# EAGLE design v1 (EAGLE 9.6.2)
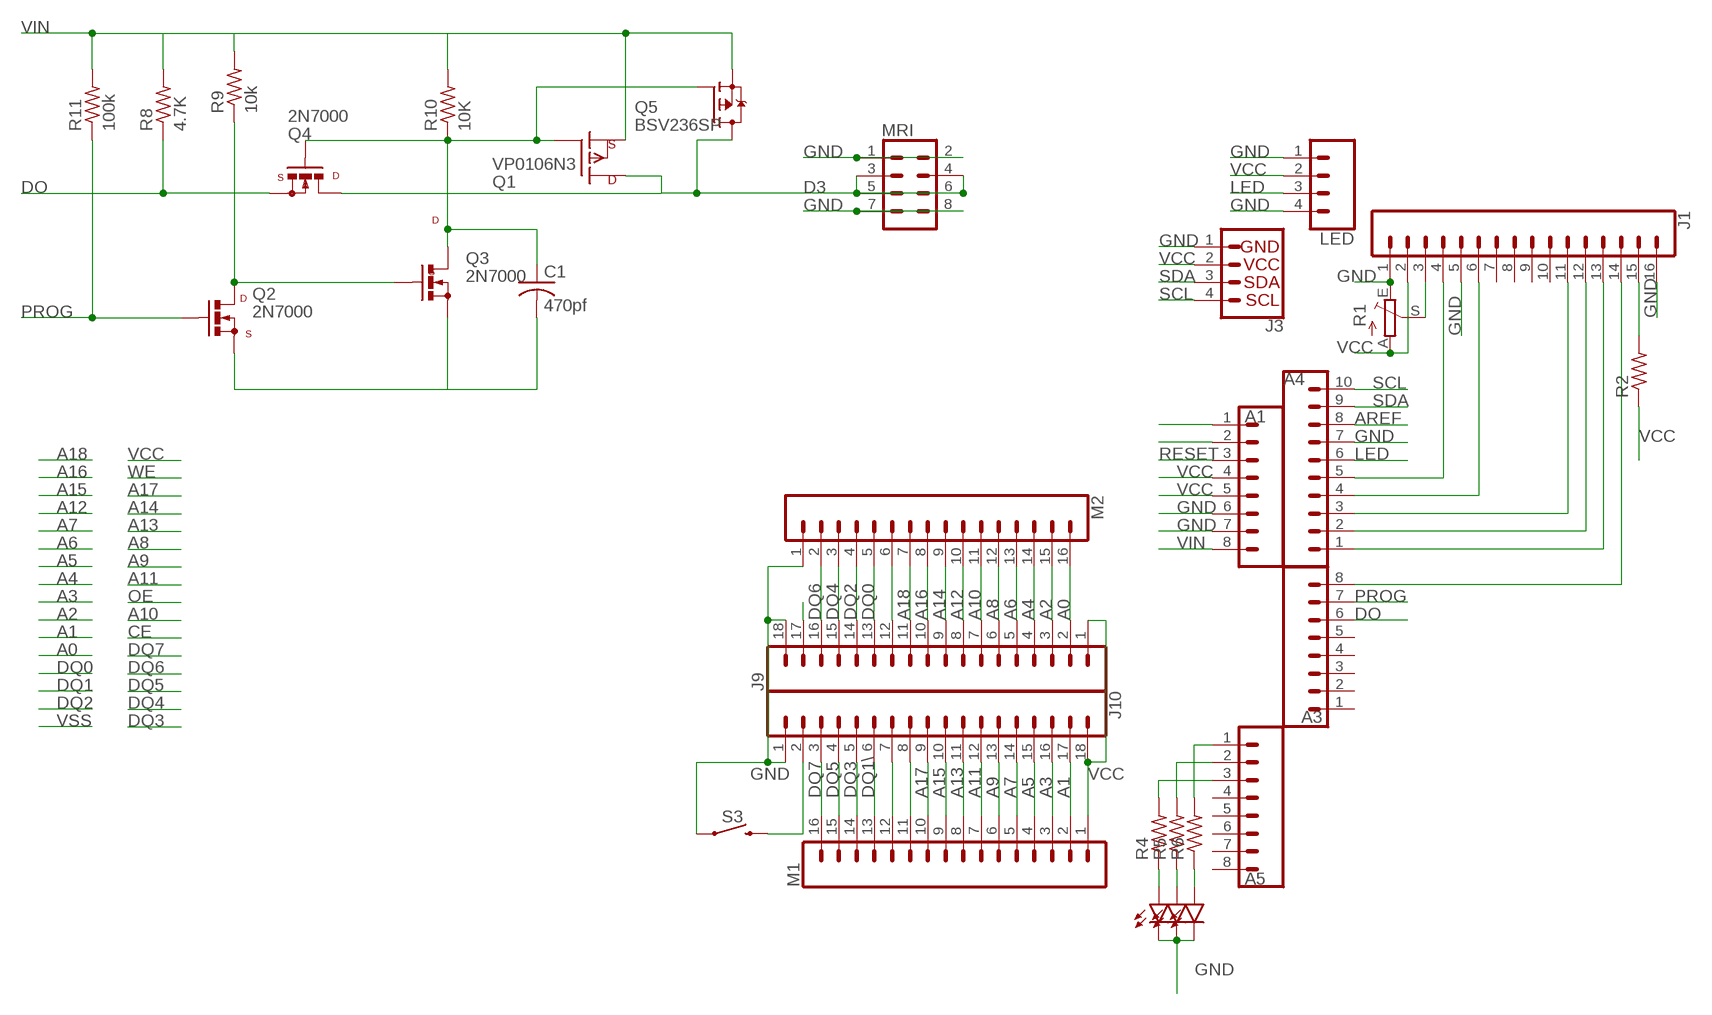
[diagram p0: schematic, sheet 1]

## Parts
A1  CONN_08FEMALE_LOCK  [1X08_FEMALE_LOCK]
A3  CONN_08FEMALE_LOCK  [1X08_FEMALE_LOCK]
A4  CONN_10LOCK  [1X10_LOCK]
A5  CONN_08FEMALE_LOCK  [1X08_FEMALE_LOCK]
C1  470pf  C-US025-025X050  [C025-025X050]
D1  LED3MM  [LED_3MM]
D2  LED3MM  [LED_3MM]
D3  LED3MM  [LED_3MM]
J1  CONN_16LOCK  [1X16_LOCK]
J3  I2C_STANDARD  [1X04]
J9  CONN_18SILK  [1X18]
J10  CONN_18SILK  [1X18]
LED  CONN_04LOCK  [1X04_LOCK]
M1  CONN_16MACHIINE-PIN_LOCK  [1X16_MACHINE-PIN-HEADER_LOCK.004]
M2  CONN_16MACHIINE-PIN_LOCK  [1X16_MACHINE-PIN-HEADER_LOCK.004]
MRI  CONN_04X2  [2X4]
Q1  VP0106N3  BSS110TO920  [TO92-]
Q2  2N7000  BS170T092-  [TO92-LINE]
Q3  2N7000  BS170T092-  [TO92-LINE]
Q4  2N7000  BS170T092-  [TO92-LINE]
Q5  BSV236SP  [SOT363_INFINEON]
R1  TRIM_EU-B64Y  [B64Y]
R2  R-US_0309/10  [0309/10]
R4  R-US_0309/10  [0309/10]
R5  R-US_0309/10  [0309/10]
R6  R-US_0309/10  [0309/10]
R8  4.7K  R-US_0207/2V  [0207/2V]
R9  10k  R-US_0309/10  [0309/10]
R10  10K  R-US_0207/2V  [0207/2V]
R11  100k  R-US_0309/10  [0309/10]
S3  MOMENTARY-SWITCH-SPST-PTH-6.0MM  [TACTILE_SWITCH_PTH_6.0MM]

## Nets
A0: J9.2 M2.16
A1: J10.17 M1.2
A2: J9.3 M2.15
A3: J10.16 M1.3
A4: J9.4 M2.14
A5: J10.15 M1.4
A6: J9.5 M2.13
A7: J10.14 M1.5
A8: J9.6 M2.12
A9: J10.13 M1.6
A10: J9.7 M2.11
A11: J10.12 M1.7
A12: J9.8 M2.10
A13: J10.11 M1.8
A14: J9.9 M2.9
A15: J10.10 M1.9
A16: J9.10 M2.8
A17: J10.9 M1.10
A18: J9.11 M2.7
AREF: A4.8
D3: MRI.3 MRI.4 MRI.5 MRI.6 Q1.1(D) Q4.1(D) Q5.1(D) Q5.2(D) Q5.5(D) Q5.6(D)
DO: A3.6 Q4.3(S) R8.1
DQ0: J9.13 M2.5
DQ1\: J10.6 M1.13
DQ2: J9.14 M2.4
DQ3: J10.5 M1.14
DQ4: J9.15 M2.3
DQ5: J10.4 M1.15
DQ6: J9.16 M2.2
DQ7: J10.3 M1.16
GND: A1.6 A1.7 A4.7 D1.K(C) D2.K(C) D3.K(C) J1.1 J1.5 J1.16 J3.1 J9.18 J10.1 LED.1 LED.4 M2.1 MRI.1 MRI.2 MRI.7 MRI.8 R1.E S3.1
LED: A4.6 LED.3
N$3: A4.3 J1.11
N$4: J1.3 R1.S
N$7: J1.15 R2.2
N$8: A4.2 J1.12
N$9: A4.1 J1.13
N$10: A3.8 J1.14
N$11: A5.1 R6.2
N$12: A4.4 J1.6
N$13: A4.5 J1.4
N$14: A5.2 R5.2
N$15: A5.3 R4.2
N$16: D3.A R6.1
N$17: D2.A R5.1
N$18: D1.A R4.1
N$22: Q2.1(D) Q3.2(G) R9.1
N$24: C1.2 Q2.3(S) Q3.3(S)
N$25: C1.1 Q1.2(G) Q3.1(D) Q4.2(G) Q5.3(G) R10.1
N$49: A1.2
N$50: A1.1
N$52: J9.17
N$57: J9.12 M2.6
N$79: J10.8 M1.11
N$80: J10.7 M1.12
N$85: J10.2 S3.3
PROG: A3.7 Q2.2(G) R11.1
RESET: A1.3
SCL: A4.10 J3.4
SDA: A4.9 J3.3
VCC: A1.4 A1.5 J1.2 J3.2 J9.1 J10.18 LED.2 M1.1 R1.A R2.1
VIN: A1.8 Q1.3(S) Q5.4(S) R8.2 R9.2 R10.2 R11.2
Unconnected: A3.1 A3.2 A3.3 A3.4 A3.5 A5.4 A5.5 A5.6 A5.7 A5.8 J1.7 J1.8 J1.9 J1.10

## Notes on the sheet
- S | D
- D
- S
- D
- S

## Library data of the parts
A1 A3 A5 = SparkFun-Connectors:CONN_08: Multi connection point. Often used as Generic Header-pin footprint for 0.1 inch spaced/style header connections On any of the 0.1 inch spaced packages, you can populate with these: Break Away Headers - Straight <https://www.sparkfun.com/products/116> (PRT-00116) Break Away Male Headers - Right Angle <https://www.sparkfun.com/products/553> (PRT-00553) Female Headers <https://www.sparkfun.com/products/115> (PRT-00115) Break Away Headers - Machine Pin <https://www.sparkfun.com/products/117> (PRT-00117) Break Away Female Headers - Swiss Machine Pin <https://www.sparkfun.com/products/743> (PRT-00743) Arduino Stackable Header - 8 Pin <https://www.sparkfun.com/products/9279> (PRT-09279) For SCREWTERMINALS and SPRING TERMINALS visit here: Screw Terimnals on SparkFun.com <https://www.sparkfun.com/search/results?term=Screw+Terminals> (5mm/3.5mm/2.54mm spacing) This device is also useful as a general connection point to wire up your design to another part of your project. Our various solder wires solder well into these plated through hole pads. Hook-Up Wire - Assortment (Stranded, 22 AWG) <https://www.sparkfun.com/products/11375> (PRT-11375) Hook-Up Wire - Assortment (Solid Core, 22 AWG) <https://www.sparkfun.com/products/11367> (PRT-11367) View the entire wire category on our website here <https://www.sparkfun.com/categories/141> Special notes: Molex polarized connector foot print use with SKU : PRT-08231 with associated crimp pins and housings. 1MM SMD Version SKU: PRT-10208 NOTES ON THE VARIANTS LOCK and LOCK_LONGPADS... This footprint was designed to help hold the alignment of a through-hole component (i.e. 6-pin header) while soldering it into place. You may notice that each hole has been shifted either up or down by 0.005 of an inch from it's more standard position (which is a perfectly straight line). This slight alteration caused the pins (the squares in the middle) to touch the edges of the holes. Because they are alternating, it causes a "brace" to hold the component in place. 0.005 has proven to be the perfect amount of "off-center" position when using our standard breakaway headers. Although looks a little odd when you look at the bare footprint, once you have a header in there, the alteration is very hard to notice. Also,if you push a header all the way into place, it is covered up entirely on the bottom side.; PROD_ID: CONN-09233; SF_ID: PRT-09279
A4 = SparkFun-Connectors:CONN_10: Multi connection point. Often used as Generic Header-pin footprint for 0.1 inch spaced/style header connections On any of the 0.1 inch spaced packages, you can populate with these: Break Away Headers - Straight <https://www.sparkfun.com/products/116> (PRT-00116) Break Away Male Headers - Right Angle <https://www.sparkfun.com/products/553> (PRT-00553) Female Headers <https://www.sparkfun.com/products/115> (PRT-00115) Break Away Headers - Machine Pin <https://www.sparkfun.com/products/117> (PRT-00117) Break Away Female Headers - Swiss Machine Pin <https://www.sparkfun.com/products/743> (PRT-00743) Arduino Stackable Header - 10 Pin <https://www.sparkfun.com/products/11376> (PRT-11376) For SCREWTERMINALS and SPRING TERMINALS visit here: Screw Terimnals on SparkFun.com <https://www.sparkfun.com/search/results?term=Screw+Terminals> (5mm/3.5mm/2.54mm spacing) This device is also useful as a general connection point to wire up your design to another part of your project. Our various solder wires solder well into these plated through hole pads. Hook-Up Wire - Assortment (Stranded, 22 AWG) <https://www.sparkfun.com/products/11375> (PRT-11375) Hook-Up Wire - Assortment (Solid Core, 22 AWG) <https://www.sparkfun.com/products/11367> (PRT-11367) View the entire wire category on our website here <https://www.sparkfun.com/categories/141> Special notes: Molex polarized connector foot print use with SKU : PRT-08231 with associated crimp pins and housings. 1MM SMD Version SKU: PRT-10208 NOTES ON THE VARIANTS LOCK and LOCK_LONGPADS... This footprint was designed to help hold the alignment of a through-hole component (i.e. 6-pin header) while soldering it into place. You may notice that each hole has been shifted either up or down by 0.005 of an inch from it's more standard position (which is a perfectly straight line). This slight alteration caused the pins (the squares in the middle) to touch the edges of the holes. Because they are alternating, it causes a "brace" to hold the component in place. 0.005 has proven to be the perfect amount of "off-center" position when using our standard breakaway headers. Although looks a little odd when you look at the bare footprint, once you have a header in there, the alteration is very hard to notice. Also,if you push a header all the way into place, it is covered up entirely on the bottom side.
C1 = rcl:C-US: CAPACITOR, American symbol
D1-D3 = SparkFun-LED:LED: LED (Generic) Standard schematic elements and footprints for 5mm, 3mm, 1206, and 0603 sized LEDs. Generic LEDs with no color specified.; PROD_ID: DIO-08794
J1 M1 M2 = SparkFun-Connectors:CONN_16: Multi connection point. Often used as Generic Header-pin footprint for 0.1 inch spaced/style header connections On any of the 0.1 inch spaced packages, you can populate with these: Break Away Headers - Straight <https://www.sparkfun.com/products/116> (PRT-00116) Break Away Male Headers - Right Angle <https://www.sparkfun.com/products/553> (PRT-00553) Female Headers <https://www.sparkfun.com/products/115> (PRT-00115) Break Away Headers - Machine Pin <https://www.sparkfun.com/products/117> (PRT-00117) Break Away Female Headers - Swiss Machine Pin <https://www.sparkfun.com/products/743> (PRT-00743) For SCREWTERMINALS and SPRING TERMINALS visit here: Screw Terimnals on SparkFun.com <https://www.sparkfun.com/search/results?term=Screw+Terminals> (5mm/3.5mm/2.54mm spacing) This device is also useful as a general connection point to wire up your design to another part of your project. Our various solder wires solder well into these plated through hole pads. Hook-Up Wire - Assortment (Stranded, 22 AWG) <https://www.sparkfun.com/products/11375> (PRT-11375) Hook-Up Wire - Assortment (Solid Core, 22 AWG) <https://www.sparkfun.com/products/11367> (PRT-11367) View the entire wire category on our website here <https://www.sparkfun.com/categories/141> Special notes: Molex polarized connector foot print use with SKU : PRT-08231 with associated crimp pins and housings. 1MM SMD Version SKU: PRT-10208 NOTES ON THE VARIANTS LOCK and LOCK_LONGPADS... This footprint was designed to help hold the alignment of a through-hole component (i.e. 6-pin header) while soldering it into place. You may notice that each hole has been shifted either up or down by 0.005 of an inch from it's more standard position (which is a perfectly straight line). This slight alteration caused the pins (the squares in the middle) to touch the edges of the holes. Because they are alternating, it causes a "brace" to hold the component in place. 0.005 has proven to be the perfect amount of "off-center" position when using our standard breakaway headers. Although looks a little odd when you look at the bare footprint, once you have a header in there, the alteration is very hard to notice. Also,if you push a header all the way into place, it is covered up entirely on the bottom side.
J3 = SparkFun-Connectors:I2C_STANDARD: SparkFun I2C Standard Pinout Header SparkFun has standardized on a pinout for all I2C based sensor breakouts. This pinout allows I2C boards to be plugged directly into the headers on Arduino Uno compatible boards, and to be daisy chained easily. Example SparkFun Products: SparkFun Atmospheric Sensor Breakout - BME280 <https://www.sparkfun.com/products/13676> SparkFun Altitude/Pressure Sensor Breakout - MPL3115A2 <https://www.sparkfun.com/products/11084> SparkFun TOF Range Finder Sensor - VL6180 <https://www.sparkfun.com/products/12785>
J9 J10 = SparkFun-Connectors:CONN_18: Multi connection point. Often used as Generic Header-pin footprint for 0.1 inch spaced/style header connections On any of the 0.1 inch spaced packages, you can populate with these: Break Away Headers - Straight <https://www.sparkfun.com/products/116> (PRT-00116) Break Away Male Headers - Right Angle <https://www.sparkfun.com/products/553> (PRT-00553) Female Headers <https://www.sparkfun.com/products/115> (PRT-00115) Break Away Headers - Machine Pin <https://www.sparkfun.com/products/117> (PRT-00117) Break Away Female Headers - Swiss Machine Pin <https://www.sparkfun.com/products/743> (PRT-00743) For SCREWTERMINALS and SPRING TERMINALS visit here: Screw Terimnals on SparkFun.com <https://www.sparkfun.com/search/results?term=Screw+Terminals> (5mm/3.5mm/2.54mm spacing) This device is also useful as a general connection point to wire up your design to another part of your project. Our various solder wires solder well into these plated through hole pads. Hook-Up Wire - Assortment (Stranded, 22 AWG) <https://www.sparkfun.com/products/11375> (PRT-11375) Hook-Up Wire - Assortment (Solid Core, 22 AWG) <https://www.sparkfun.com/products/11367> (PRT-11367) View the entire wire category on our website here <https://www.sparkfun.com/categories/141> Special notes: Molex polarized connector foot print use with SKU : PRT-08231 with associated crimp pins and housings. 1MM SMD Version SKU: PRT-10208 NOTES ON THE VARIANTS LOCK and LOCK_LONGPADS... This footprint was designed to help hold the alignment of a through-hole component (i.e. 6-pin header) while soldering it into place. You may notice that each hole has been shifted either up or down by 0.005 of an inch from it's more standard position (which is a perfectly straight line). This slight alteration caused the pins (the squares in the middle) to touch the edges of the holes. Because they are alternating, it causes a "brace" to hold the component in place. 0.005 has proven to be the perfect amount of "off-center" position when using our standard breakaway headers. Although looks a little odd when you look at the bare footprint, once you have a header in there, the alteration is very hard to notice. Also,if you push a header all the way into place, it is covered up entirely on the bottom side.
LED = SparkFun-Connectors:CONN_04: Multi connection point. Often used as Generic Header-pin footprint for 0.1 inch spaced/style header connections On any of the 0.1 inch spaced packages, you can populate with these: Break Away Headers - Straight <https://www.sparkfun.com/products/116> (PRT-00116) Break Away Male Headers - Right Angle <https://www.sparkfun.com/products/553> (PRT-00553) Female Headers <https://www.sparkfun.com/products/115> (PRT-00115) Break Away Headers - Machine Pin <https://www.sparkfun.com/products/117> (PRT-00117) Break Away Female Headers - Swiss Machine Pin <https://www.sparkfun.com/products/743> (PRT-00743) For SCREWTERMINALS and SPRING TERMINALS visit here: Screw Terimnals on SparkFun.com <https://www.sparkfun.com/search/results?term=Screw+Terminals> (5mm/3.5mm/2.54mm spacing) This device is also useful as a general connection point to wire up your design to another part of your project. Our various solder wires solder well into these plated through hole pads. Hook-Up Wire - Assortment (Stranded, 22 AWG) <https://www.sparkfun.com/products/11375> (PRT-11375) Hook-Up Wire - Assortment (Solid Core, 22 AWG) <https://www.sparkfun.com/products/11367> (PRT-11367) View the entire wire category on our website here <https://www.sparkfun.com/categories/141> Special notes: Molex polarized connector foot print use with SKU : PRT-08231 with associated crimp pins and housings. 1MM SMD Version SKU: PRT-10208; PROD_ID: CONN-09696
MRI = SparkFun-Connectors:CONN_04X2: Multi connection point. Often used as Generic Header-pin footprint for 0.1 inch spaced/style header connections On any of the 0.1 inch spaced packages, you can populate with these: Break Away Headers - Straight <https://www.sparkfun.com/products/116> (PRT-00116) Break Away Male Headers - Right Angle <https://www.sparkfun.com/products/553> (PRT-00553) Female Headers <https://www.sparkfun.com/products/115> (PRT-00115) Break Away Headers - Machine Pin <https://www.sparkfun.com/products/117> (PRT-00117) Break Away Female Headers - Swiss Machine Pin <https://www.sparkfun.com/products/743> (PRT-00743)
Q1 = transistor-fet:BSS110: P-Channel Enhancement MOSFET -50V; -0,17A; 6Ohm
Q2-Q4 = transistor-small-signal:BS170: N-CHANNEL MOS FET
Q5 = transistor-fet:BSV236SP: OptiMOS(R)-P Small-Signal-Transistor P-Channel, Enhancement mode, Super Logic Level (2.5 V rated) Source: http://www.infineon.com/upload/Document/BSV236SP_Rev1.3.pdf
R1 = pot:TRIM_EU-: POTENTIOMETER
R2 R4-R6 = rcl:R-US_: RESISTOR, American symbol; SPICEPREFIX: R
R8-R11 = rcl:R-US_: RESISTOR, American symbol
S3 = SparkFun-Switches:MOMENTARY-SWITCH-SPST: Momentary Switch (Pushbutton) - SPST Normally-open (NO) SPST momentary switches (buttons, pushbuttons). Variants PTH-12MM - 12mm square, through-hole Momentary Pushbutton Switch - 12mm Square <https://www.sparkfun.com/products/9190> (COM-09190) PTH-6.0MM, PTH-6.0MM-KIT - 6.0mm square, through-hole Mini Pushbutton Switch <https://www.sparkfun.com/products/97> (COM-00097) KIT package intended for soldering kit's - only one side of pads' copper is exposed. PTH-RIGHT-ANGLE-KIT - Right-angle, through-hole Right Angle Tactile Button <https://www.sparkfun.com/products/10791> - Used on SparkFun BigTime Watch Kit <https://www.sparkfun.com/products/11734> SMD-12MM - 12mm square, surface-mount Tactile Button - SMD (12mm) <https://www.sparkfun.com/products/12993> (COM-12993) Used on SparkFun PicoBoard <https://www.sparkfun.com/products/11888> SMD-4.5MM - 4.5mm Square Trackball Switch Used on SparkFun Blackberry Trackballer Breakout <https://www.sparkfun.com/products/13169> SMD-4.6MMX2.8MM - 4.60mm x 2.80mm, surface mount Used on SparkFun Pro Micro - RP2040 <https://www.sparkfun.com/products/17717> SMD-5.2MM, SMD-5.2-REDUNDANT - 5.2mm square, surface-mount Mini Pushbutton Switch - SMD <https://www.sparkfun.com/products/8720> (COM-08720) Used on Arduino Pro Mini <https://www.sparkfun.com/products/11114> REDUNDANT package connects both switch circuits together SMD-6.0X3.5MM - 6.0 x 3.5mm, surface mount Momentary Reset Switch SMD <https://www.sparkfun.com/products/8229> (COM-08229) SMD-6.2MM-TALL - 6.2mm square, surface mount Tactile Button - SMD (6mm) <https://www.sparkfun.com/products/12992> Used on SparkFun Digital Sandbox <https://www.sparkfun.com/products/12651> SMD-RIGHT-ANGLE - Right-angle, surface mount Used on SparkFun Block for Intel® Edison - Arduino <https://www.sparkfun.com/products/13036>; PROD_ID: SWCH-08441; SF_SKU: COM-00097

## Board
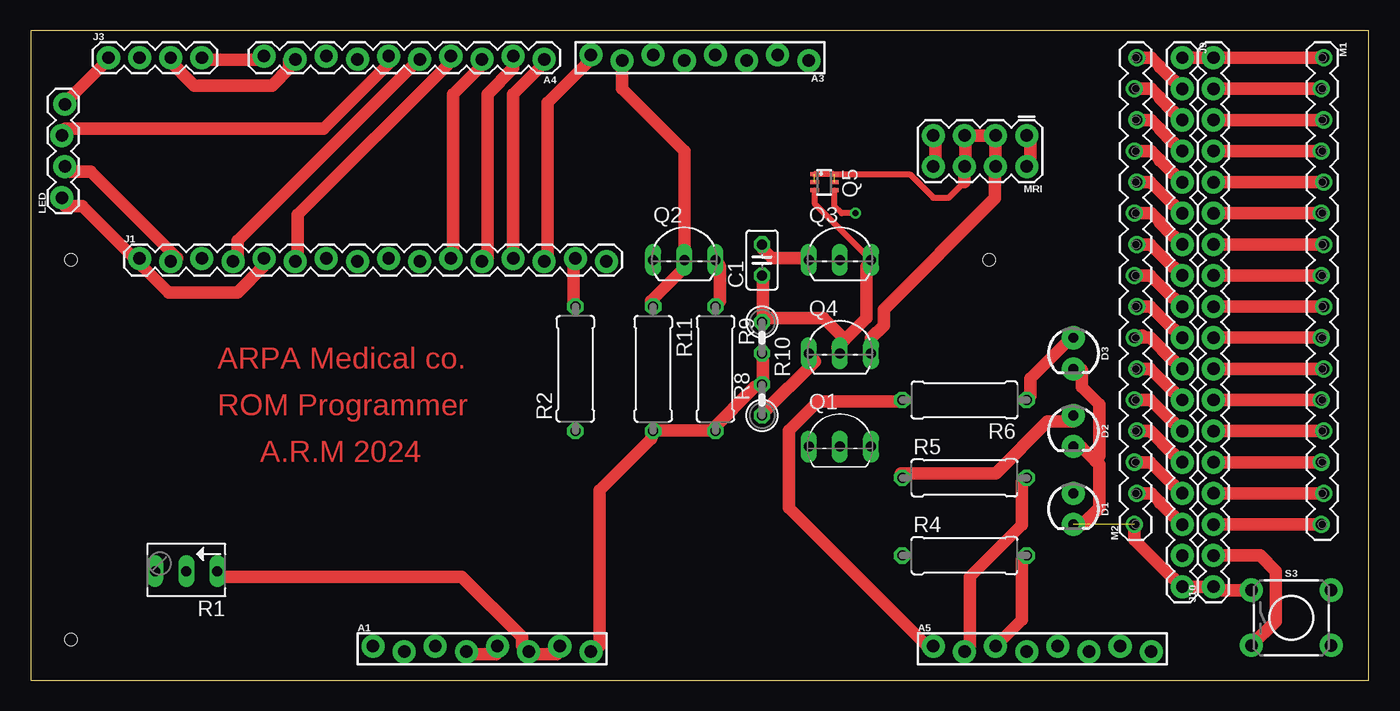
[diagram p1: board, top side]
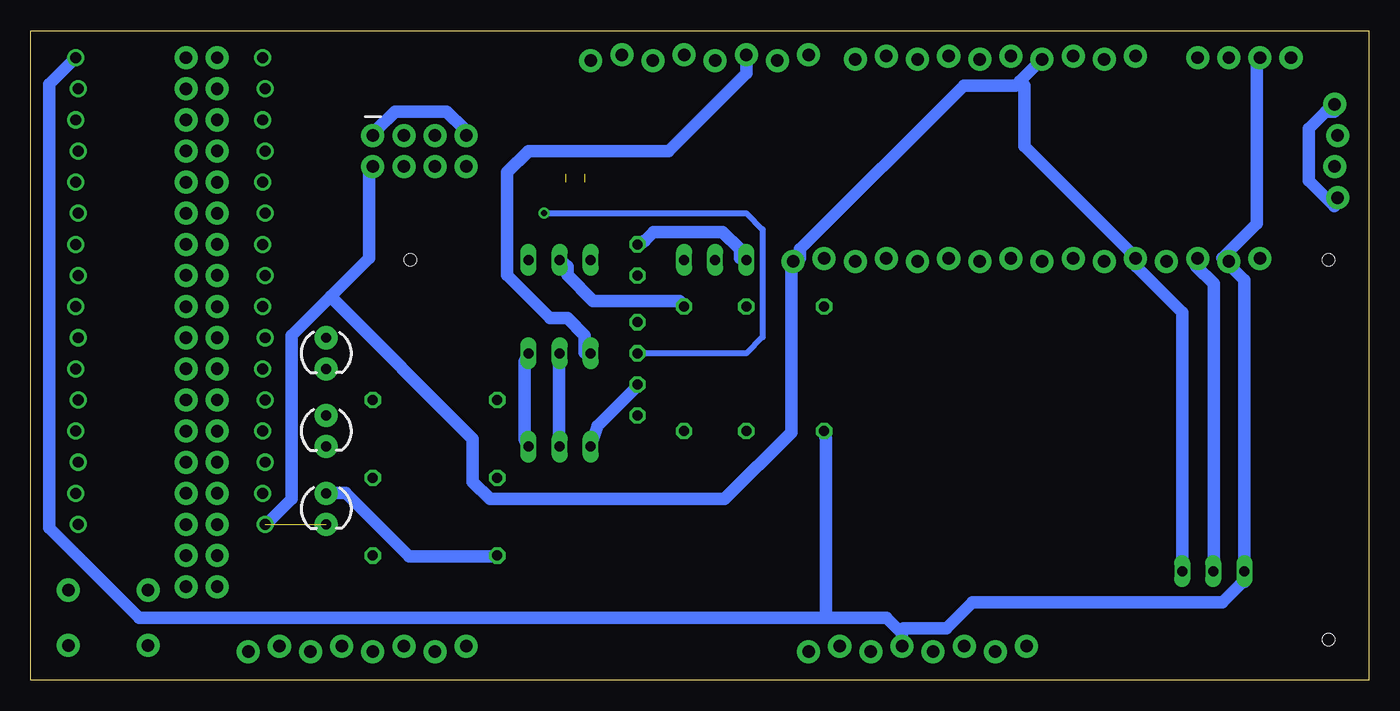
[diagram p2: board, bottom side, seen from below]

Size 109.2 x 53.01 mm. Coordinates in mm from the lower left corner, seen from the top.
Outline: 0,0 109.2,0 109.2,53.01 0,53.01 0,0
Copper layers (1*16): Top 0.035mm / dielectric 1.5mm / Bottom 0.035mm
Design rules "default *": minimum track width 0.5mm, minimum drill 0.5mm, track to track 16mil, track to pad 16mil, pad to pad 16mil, via to via 16mil, smd to smd 16mil, copper to edge 40mil, drill to drill 16mil, minimum pad ring 10mil, minimum via ring 8mil, stop-mask expansion 4mil, vias tented up to drill 0mil, thermal gap 10mil
Holes 1 mm at 3.3,3.3 3.3,34.29 78.23,34.29

### Footprints (pad centres in the part's own frame; a part is rotated, then mirrored left to right if it is on the bottom)
1X08_FEMALE_LOCK = drill 1.016 pad 1.88: 1 0,0.229; 2 2.54,-0.229; 3 5.08,0.229; 4 7.62,-0.229; 5 10.16,0.229; 6 12.7,-0.229; 7 15.24,0.229; 8 17.78,-0.229
1X10_LOCK = drill 1.016 pad 1.88: 1 0,0.127; 2 2.54,-0.127; 3 5.08,0.127; 4 7.62,-0.127; 5 10.16,0.127; 6 12.7,-0.127; 7 15.24,0.127; 8 17.78,-0.127; 9 20.32,0.127; 10 22.86,-0.127
C025-025X050 = drill 0.813 octagon: 1 -1.27,0; 2 1.27,0
LED_3MM = drill 0.813 pad 1.88: A -1.27,0; K 1.27,0
1X16_LOCK = drill 1.016 pad 1.88: 1 0,0.127; 2 2.54,-0.127; 3 5.08,0.127; 4 7.62,-0.127; 5 10.16,0.127; 6 12.7,-0.127; 7 15.24,0.127; 8 17.78,-0.127; 9 20.32,0.127; 10 22.86,-0.127; 11 25.4,0.127; 12 27.94,-0.127; 13 30.48,0.127; 14 33.02,-0.127; 15 35.56,0.127; 16 38.1,-0.127
1X04 = drill 1.016 pad 1.88: 1 0,0; 2 2.54,0; 3 5.08,0; 4 7.62,0
1X18 = drill 1.016 pad 1.88: 1 0,0; 2 2.54,0; 3 5.08,0; 4 7.62,0; 5 10.16,0; 6 12.7,0; 7 15.24,0; 8 17.78,0; 9 20.32,0; 10 22.86,0; 11 25.4,0; 12 27.94,0; 13 30.48,0; 14 33.02,0; 15 35.56,0; 16 38.1,0; 17 40.64,0; 18 43.18,0
1X04_LOCK = drill 1.016 pad 1.88: 1 0,0.127; 2 2.54,-0.127; 3 5.08,0.127; 4 7.62,-0.127
1X16_MACHINE-PIN-HEADER_LOCK.004 = drill 0.889: 1 0,0.102; 2 2.54,-0.102; 3 5.08,0.102; 4 7.62,-0.102; 5 10.16,0.102; 6 12.7,-0.102; 7 15.24,0.102; 8 17.78,-0.102; 9 20.32,0.102; 10 22.86,-0.102; 11 25.4,0.102; 12 27.94,-0.102; 13 30.48,0.102; 14 33.02,-0.102; 15 35.56,0.102; 16 38.1,-0.102
2X4 = drill 1.016 pad 1.88: 1 -3.81,-1.27; 2 -3.81,1.27; 3 -1.27,-1.27; 4 -1.27,1.27; 5 1.27,-1.27; 6 1.27,1.27; 7 3.81,-1.27; 8 3.81,1.27
TO92- = drill 0.813 long: 1 2.54,0; 2 0,0; 3 -2.54,0
TO92-LINE = drill 0.813 long: 1 2.54,0; 2 0,0; 3 -2.54,0
SOT363_INFINEON = smd 0.3 x 0.7: 1 -0.65,-0.8; 2 0,-0.8; 3 0.65,-0.8; 4 0.65,0.8; 5 0,0.8; 6 -0.65,0.8
B64Y = drill 0.813 long: A 2.54,0; E -2.54,0; S 0,0
0309/10 = drill 0.813 octagon: 1 -5.08,0; 2 5.08,0
0207/2V = drill 0.813 octagon: 1 -1.27,0; 2 1.27,0
TACTILE_SWITCH_PTH_6.0MM = drill 1.016 pad 1.88: 1 -3.251,2.261; 2 3.251,2.261; 3 -3.251,-2.261; 4 3.251,-2.261

### Placement (x,y rotation side)
A1  27.94,2.54 0 top
A3  63.5,50.8 180 top
A4  41.91,50.8 180 top
A5  73.66,2.54 0 top
C1  59.69,34.29 90 top
D1  85.09,13.97 270 top
D2  85.09,20.32 270 top
D3  85.09,26.67 270 top
J1  8.89,34.29 0 top
J3  6.35,50.8 0 top
J9  93.98,50.8 270 top
J10  96.52,7.62 90 top
LED  2.67,39.37 90 top
M1  105.41,50.8 270 top
M2  90.17,12.7 90 top
MRI  77.47,43.18 180 top
Q1  66.04,19.05 0 top
Q2  53.34,34.29 0 top
Q3  66.04,34.29 0 top
Q4  66.04,26.67 0 top
Q5  64.77,40.64 270 top
R1  12.7,8.89 180 top
R2  44.45,25.4 90 top
R4  76.2,10.16 0 top
R5  76.2,16.51 0 top
R6  76.2,22.86 180 top
R8  59.69,22.86 90 top
R9  55.88,25.4 270 top
R10  59.69,27.94 270 top
R11  50.8,25.4 270 top
S3  102.87,5.08 0 top

### Tracks (layer width: path | path; a pad name or v marks a point on that pad's centre or on a via)
A0
  Top 1: M2.16 91.44,50.8 92.13,50.11 92.13,50.03 93.22,48.95 93.29,48.95 J9.2
A1
  Top 1: J10.17 M1.2
A2
  Top 1: J9.3 93.29,46.41 93.22,46.41 92.13,47.49 92.13,47.57 91.44,48.26 M2.15
A3
  Top 1: M1.3 J10.16
A4
  Top 1: J9.4 93.29,43.87 93.22,43.87 92.13,44.95 92.13,45.03 91.44,45.72 M2.14
A5
  Top 1: J10.15 M1.4
A6
  Top 1: J9.5 93.29,41.33 93.22,41.33 92.13,42.41 92.13,42.49 91.44,43.18 M2.13
A7
  Top 1: M1.5 J10.14
A8
  Top 1: J9.6 93.29,38.79 93.22,38.79 91.37,40.64 M2.12
A9
  Top 1: J10.13 M1.6
A10
  Top 1: J9.7 93.29,36.25 93.22,36.25 92.13,37.34 92.13,37.41 91.44,38.1 M2.11
A11
  Top 1: M1.7 J10.12
A12
  Top 1: J9.8 93.29,33.71 93.22,33.71 91.37,35.56 M2.10
A13
  Top 1: J10.11 M1.8
A14
  Top 1: J9.9 93.29,31.17 93.22,31.17 91.37,33.02 M2.9
A15
  Top 1: M1.9 J10.10
A16
  Top 1: J9.10 93.29,28.63 93.22,28.63 91.37,30.48 M2.8
A17
  Top 1: J10.9 M1.10 | M1.10 105.41,27.94 105.48,28.13 M1.10
A18
  Top 1: J9.11 93.29,26.09 93.22,26.09 91.37,27.94 90.71,27.94 | 90.71,27.94 90.17,27.94 | M2.7 90.71,28.13 90.71,27.94
D3  (2 unrouted)
  Top 0.508: Q5.1 Q5.6 71.74,41.29 73.66,39.37 74.93,39.37 76.2,40.64 76.27,40.71 76.27,42.19
  Top 1: 76.27,42.19 76.27,44.3 76.65,44.3 MRI.5 MRI.3 MRI.4 78.69,41.88 78.69,39.32 69.62,30.25 69.62,28.95 68.58,27.91 Q4.1 | MRI.6 76.2,40.64
  Bottom 1: Q1.1 68.91,19.69 68.91,26.02 Q4.1
DO
  Top 1: R8.1 59.77,21.8 63.99,26.02 Q4.3
  Bottom 1: Q4.3 63.99,26.72 63.99,28.13 65.4,29.53 66.8,29.53 70.32,33.05 70.32,41.44 68.58,43.18 57.15,43.18 50.8,49.53 A3.6
DQ0
  Top 1: J9.13 93.29,21.01 93.22,21.01 91.37,22.86 M2.5
DQ1\
  Top 1: M1.13 J10.6
DQ2
  Top 1: J9.14 93.29,18.47 93.22,18.47 91.37,20.32 M2.4
DQ3
  Top 1: J10.5 M1.14
DQ4
  Top 1: J9.15 93.29,15.93 93.22,15.93 91.37,17.78 M2.3
DQ5
  Top 1: M1.15 J10.4
DQ6
  Top 1: J9.16 93.29,13.39 93.22,13.39 92.13,14.47 92.13,14.55 91.44,15.24 M2.2
DQ7
  Top 1: J10.3 M1.16
GND  (1 unrouted)
  Top 1: S3.1 96.8,7.34 J10.1 J9.18 93.29,8.31 93.22,8.31 90.07,11.46 M2.1 | MRI.8 73.84,42.19 73.84,44.3 MRI.7 | MRI.2 81.57,42.19 81.57,44.3 MRI.1 | LED.4 2.81,47.11 6.33,50.63 J3.1 | LED.1 2.81,38.68 4.22,38.68 8.44,34.46 J1.1 9.14,33.75 11.25,31.64 16.88,31.64 18.99,33.75 J1.5 | A1.7 42.9,2.11 40.79,2.11 A1.6 40.08,2.81 40.08,3.52 35.16,8.44 15.47,8.44 R1.E | 86.84,17.93 85.79,18.99 D2.K | 86.84,17.93 87.2,17.58 87.2,14.06 85.79,12.66 D1.K | D3.K 85.79,25.32 85.79,23.91 87.2,22.5 87.2,18.28 86.84,17.93
  Bottom 1: MRI.7 73.84,45.01 75.24,46.41 79.46,46.41 80.87,45.01 MRI.1 | 84.74,31.29 87.9,28.13 87.9,14.77 90.01,12.66 M2.1 | 84.74,31.29 81.57,34.46 81.57,41.49 MRI.2 | 28.48,48.87 26.72,50.63 A4.7 | 28.48,48.87 28.83,48.52 33.05,48.52 46.41,35.16 46.41,34.46 J1.16 47.11,33.75 47.11,20.21 52.56,14.77 71.73,14.77 73.13,16.17 73.13,19.69 84.74,31.29 | LED.4 2.81,46.41 3.52,46.41 4.92,45.01 4.92,40.79 2.81,38.68 LED.1 | R1.E 15.24,30.01 18.99,33.75 J1.5 18.99,34.46 28.13,43.6 28.13,48.52 28.48,48.87
LED
  Top 1: LED.3 2.81,45.01 23.91,45.01 29.53,50.63 A4.6
N$3
  Top 1: J1.11 34.46,34.46 34.46,47.82 37.27,50.63 A4.3
N$4
  Bottom 1: R1.S 12.66,9.14 12.66,32.35 14.06,33.75 J1.3
N$7
  Top 1: R2.2 44.3,30.94 44.3,33.75 J1.15
N$8
  Top 1: J1.12 37.27,34.46 37.27,47.82 39.38,49.93 39.38,50.63 A4.2
N$9
  Top 1: J1.13 39.38,34.46 39.38,47.82 42.19,50.63 A4.1
N$10
  Top 1: J1.14 42.19,34.46 42.19,47.11 45.71,50.63 A3.8
N$11
  Top 1: R6.2 71.09,22.76 64.25,22.76 61.88,20.39 61.88,14.06 73.13,2.81 A5.1
N$12
  Top 1: J1.6 21.8,34.46 21.8,37.97 34.46,50.63 A4.4
N$13
  Top 1: J1.4 16.88,34.46 16.88,35.86 31.64,50.63 A4.5
N$14
  Top 1: R5.2 80.87,16.17 80.87,12.66 76.65,8.44 76.65,2.81 A5.2
N$15
  Top 1: R4.2 80.87,9.85 80.87,4.92 78.76,2.81 A5.3
N$16
  Top 1: R6.1 81.57,23.21 81.57,24.61 85.09,28.13 D3.A
N$17
  Top 1: R5.1 71.02,16.88 78.76,16.88 82.98,21.1 85.09,21.1 D2.A
N$18
  Bottom 1: D1.A 85.06,15.28 83.49,15.28 78.31,10.1 71.24,10.1 R4.1
N$22
  Top 1: R9.1 56.26,30.94 56.26,33.75 Q2.1
  Bottom 1: Q3.2 65.4,33.75 65.4,33.05 63.29,30.94 56.26,30.94 R9.1
N$24
  Top 1: Q3.3 63.29,34.46 60.48,34.46 59.77,35.16 C1.2
  Bottom 1: Q2.3 51.33,34.46 51.33,35.16 52.74,36.57 58.37,36.57 59.07,35.86 C1.2
N$25
  Top 0.508: Q5.3 63.97,38.9 Q3.1
  Top 1: 59.77,29.53 59.77,33.05 C1.1 | Q4.2 66.16,26.79 65.82,27.14 66.45,27.78 | 66.45,27.78 68.21,29.53 68.21,33.75 Q3.1 | 59.77,29.53 64.69,29.53 66.45,27.78 | 59.77,29.53 R10.1
  Bottom 1: Q1.2 66.1,19.69 66.1,26.02 Q4.2
N$57
  Top 1: J9.12 93.29,23.55 93.22,23.55 91.37,25.4 M2.6
N$79
  Top 1: M1.11 J10.8
N$80
  Top 1: J10.7 M1.12
N$85
  Top 1: S3.3 101.6,4.8 101.6,8.89 100.33,10.16 J10.2
PROG
  Top 1: R11.1 50.63,30.94 53.44,33.75 Q2.2 53.34,43.18 48.26,48.26 A3.7
SCL
  Top 1: J3.4 14.06,50.63 18.99,50.63 A4.10
SDA
  Top 1: A4.9 21.1,50.63 21.1,49.93 19.69,48.52 13.36,48.52 11.25,50.63 J3.3
VCC
  Top 1: M1.1 J10.18 J9.1 | A1.4 35.86,2.11 37.97,2.11 A1.5 | LED.2 2.81,41.49 4.92,41.49 11.95,34.46 J1.2
  Bottom 1: M1.1 107.68,48.63 107.68,12.43 100.33,5.08 44.3,5.08 | 44.3,5.08 39.37,5.08 38.1,3.81 | 38.1,3.81 A1.5 | 44.3,5.08 44.3,19.69 R2.1 | J3.2 9.14,50.63 9.14,37.27 11.95,34.46 J1.2 11.25,33.75 10.16,32.66 R1.A 10.16,8.02 10.2,8.08 11.95,6.33 32.35,6.33 34.46,4.22 37.97,4.22 38.1,3.81
VIN  (via drill 0.5)
  Top 0.508: Q5.4 65.57,38.72 66.19,38.1 v67.31,38.1
  Top 1: R10.2 59.77,26.02 59.77,24.61 R8.2 59.07,23.91 55.55,20.39 | 55.55,20.39 51.33,20.39 R11.2 50.63,19.69 46.41,15.47 46.41,2.81 A1.8 | 55.55,20.39 R9.2
  Bottom 0.508: v67.31,38.1 50.8,38.1 49.48,36.78 49.48,27.99 50.8,26.67 R10.2
  Bottom 1: Q1.3 62.94,20.74 59.77,23.91 R8.2

### Text on the board
Top: ARPA Medical co. | ROM Programmer | A.R.M 2024